# Altium schematic sheet Nucleo.SchDoc: Nucleo
size A4; Organization: BME AUT; Address1: Magyar tudósok krt. 2.; Address2: Q épület; Address3: Budapest; Address4: H-1117; DocumentNumber: 1; Revision: 1.0; SheetNumber: 1; SheetTotal: 2
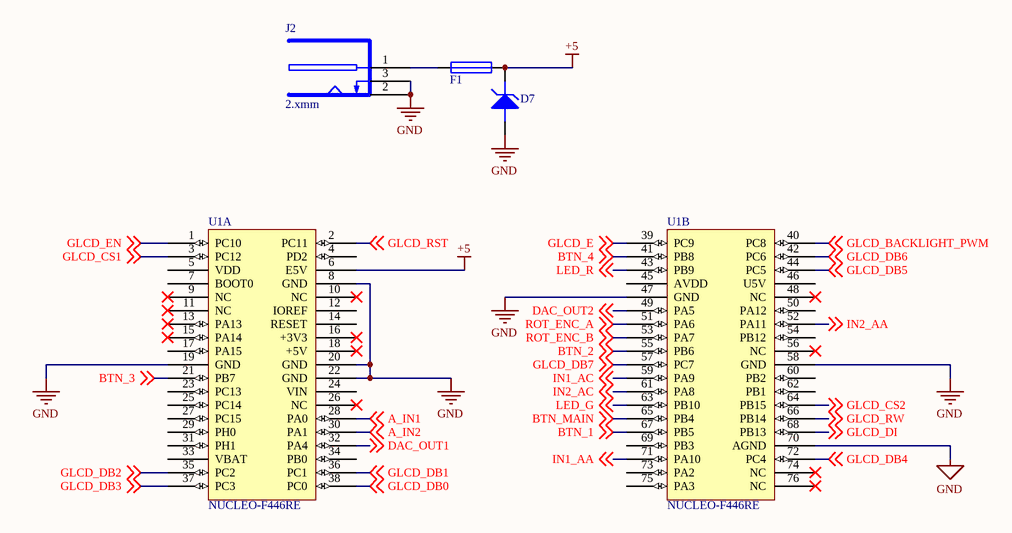
[diagram p0: Nucleo.SchDoc]

## Parts
D7  TRANS SUPPR  [FP_SMB]  (value not drawn)
F1  Multifuse  [FP_MULTIFUSE]  (value not drawn)
J2  2.xmm  [FP_DC_TAP_ANYA]
U1  NUCLEO-F446RE  [FP_NUCLEO-64]  (parts A,B of 2)

## Nets
+5: D7.1(CATHODE) F1.2 U1.6(E5V)
GND: D7.2(ANODE) J2.2(SLEEVE) J2.3(BREAK) U1.8(GND) U1.19(GND) U1.20(GND) U1.22(GND) U1.47(GND) U1.58(GND) U1.70(AGND)
A_IN1: U1.28(PA0) ; off-sheet A_IN1
A_IN2: U1.30(PA1) ; off-sheet A_IN2
BTN_1: U1.67(PB5) ; off-sheet BTN_1
BTN_2: U1.55(PB6) ; off-sheet BTN_2
BTN_3: U1.21(PB7) ; off-sheet BTN_3
BTN_4: U1.41(PB8) ; off-sheet BTN_4
BTN_MAIN: U1.65(PB4) ; off-sheet BTN_MAIN
DAC_OUT1: U1.32(PA4) ; off-sheet DAC_OUT1
DAC_OUT2: U1.49(PA5) ; off-sheet DAC_OUT2
GLCD_BACKLIGHT_PWM: U1.40(PC8) ; off-sheet GLCD_BACKLIGHT_PWM
GLCD_CS1: U1.3(PC12) ; off-sheet GLCD_CS1
GLCD_CS2: U1.64(PB15) ; off-sheet GLCD_CS2
GLCD_DB0: U1.38(PC0) ; off-sheet GLCD_DB0
GLCD_DB1: U1.36(PC1) ; off-sheet GLCD_DB1
GLCD_DB2: U1.35(PC2) ; off-sheet GLCD_DB2
GLCD_DB3: U1.37(PC3) ; off-sheet GLCD_DB3
GLCD_DB4: U1.72(PC4) ; off-sheet GLCD_DB4
GLCD_DB5: U1.44(PC5) ; off-sheet GLCD_DB5
GLCD_DB6: U1.42(PC6) ; off-sheet GLCD_DB6
GLCD_DB7: U1.57(PC7) ; off-sheet GLCD_DB7
GLCD_DI: U1.68(PB13) ; off-sheet GLCD_DI
GLCD_E: U1.39(PC9) ; off-sheet GLCD_E
GLCD_EN: U1.1(PC10) ; off-sheet GLCD_EN
GLCD_RST: U1.2(PC11) ; off-sheet GLCD_RST
GLCD_RW: U1.66(PB14) ; off-sheet GLCD_RW
IN1_AA: U1.71(PA10) ; off-sheet IN1_AA
IN1_AC: U1.59(PA9) ; off-sheet IN1_AC
IN2_AA: U1.52(PA11) ; off-sheet IN2_AA
IN2_AC: U1.61(PA8) ; off-sheet IN2_AC
LED_G: U1.63(PB10) ; off-sheet LED_G
LED_R: U1.43(PB9) ; off-sheet LED_R
ROT_ENC_A: U1.51(PA6) ; off-sheet ROT_ENC_A
ROT_ENC_B: U1.53(PA7) ; off-sheet ROT_ENC_B
NetF1_1: F1.1 J2.1(PIN)

Not connected (* = marked no-connect by the designer): U1 4(PD2) 5(VDD) 7(BOOT0) 9(NC)* 10(NC)* 11(NC)* 12(IOREF) 13(PA13)* 14(RESET) 15(PA14)* 16(+3V3)* 17(PA15) 18(+5V)* 23(PC13) 24(VIN) 25(PC14) 26(NC)* 27(PC15) 29(PH0) 31(PH1) 33(VBAT) 34(PB0) 45(AVDD) 46(U5V) 48(NC)* 50(PA12) 54(PB12) 56(NC)* 60(PB2) 62(PB1) 69(PB3) 73(PA2) 74(NC)* 75(PA3) 76(NC)*

## Notes on the sheet
- Title
- Size:
- Date:
- A4
- Number:
- Time:
- Revision:
- Sheet
- of
- File:

## Library data of the parts
D7 = TRANS SUPPR: Transient suppressor; Name: 6.7V Ubr 600W UNIDIR. 5V Urwm SMBJ5.0A (STM) DO-214AA (SMB) ˝BUZ˝; Voltage: 6.7V; Supplier: Lomex; Reference: 96-03-67
F1 = Multifuse: 1812 Multifuse; Name: 1.25A 15V 1812L125/16DR POLYFUSE SMD 1812 (LFS) ˝LF125-16˝; Reference: 44-04-71; Supplier: Lomex
J2 = DC_TAP_ANYA: 2.xmm DC HEBA25 TÁPFESZÜLTSÉG ALJZAT ZÁRT, NYÁKBA 90°; Name: TÁP DC ANYA 5.5/2.1/9.5mm DCS-5521-5; Supplier: Lomex; Reference: 43-07-67
U1 = NUCLEO-F446RE: Reference: NUCLEO; Name: Nucleo F446RE; Supplier: Tanszék